# EasyEDA Pro project fg.eprj

# Schematic Schematic1
Board Name: Board1; Create Date: 2026-02-05; Page Name: P1; Project Name: FORKGUARD_MAIN_BOARD; Schematic Name: Schematic1; Update Date: 2026-02-05; Company: EasyEDA.com; Page Size: A4; Version: V1.0
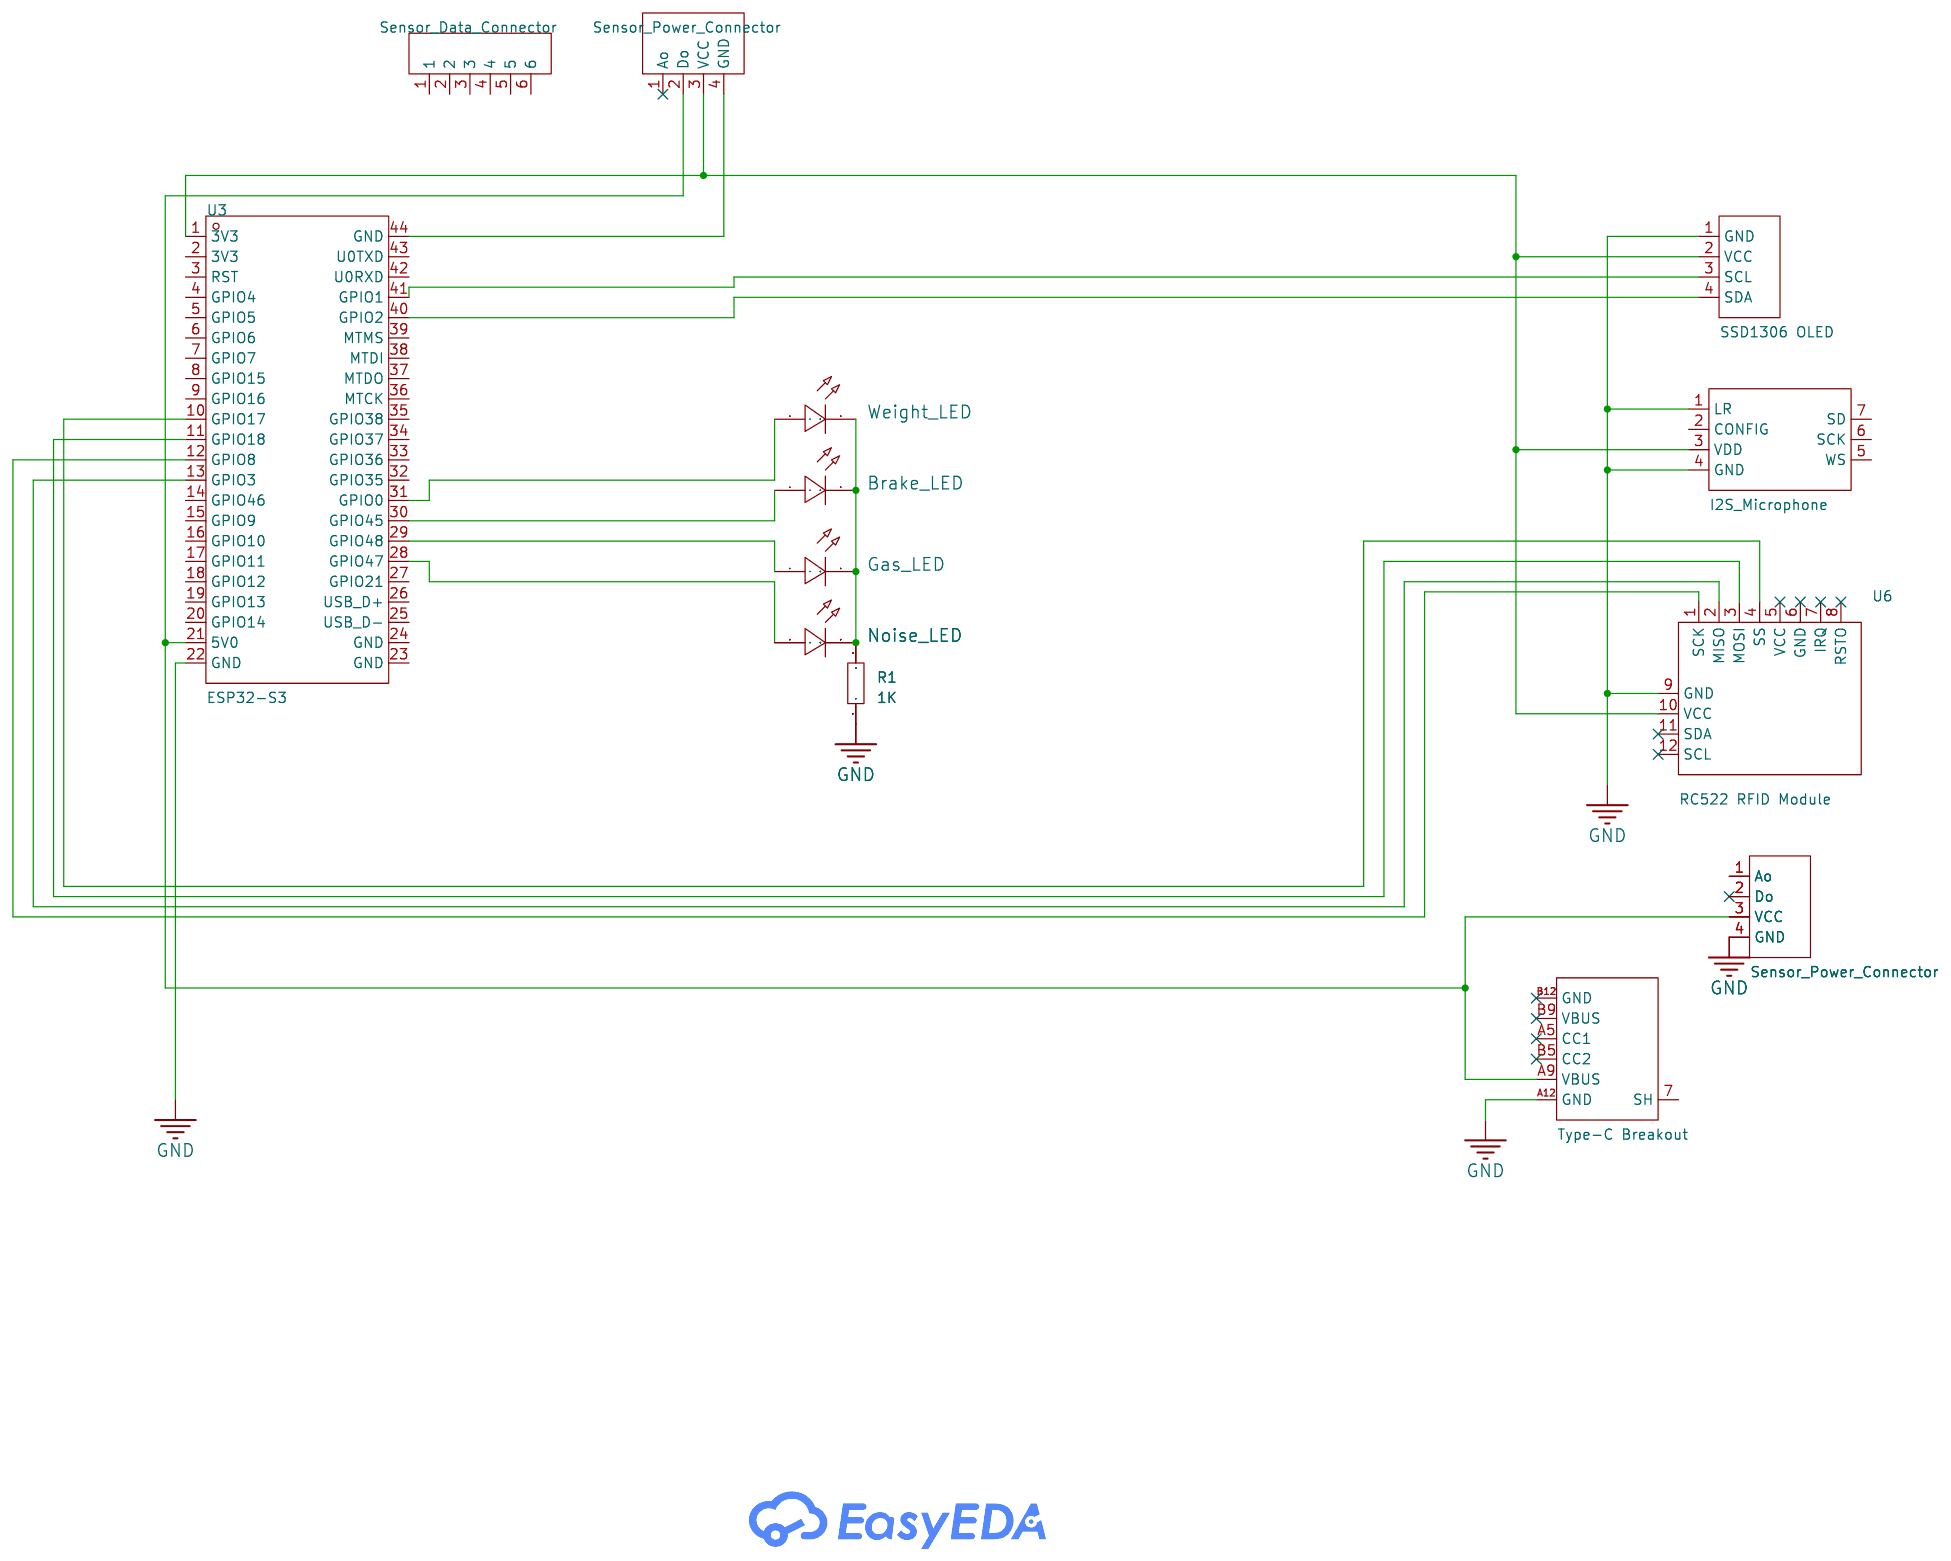
[diagram p0: schematic sheet]

## Parts
Brake_LED  -  [LED0402-RD_YELLOW]
Display  SSD1306 OLED  [OLED-TH_4P-L27.8-W27.3_MC096GW]
Gas_LED  -  [LED0402-RD_YELLOW]
H1  Sensor_Data_Connector  [HDR-TH_TW-06-01-T-S-150-085]
H2  Sensor_Power_Connector  [HDR-TH_TW-04-06-T-S-433-120]
H3  Sensor_Power_Connector  [HDR-TH_TW-04-06-T-S-433-120]
Noise_LED  -  [LED0402-RD_YELLOW]
R1  10K  [R0603]
U3  ESP32-S3  [COMM-TH_L63.3-W25.4-P2.54-LS22.86]
U5  I2S_Microphone  [MIC-SMD_7P-L4.0-W3.0-P2.15-TL]
U6  RC522 RFID Module  [COMM-TH_L42.7-W40.4_PN532_NFC_RFID]
USB1  Type-C Breakout  [USB-SMD_TYPE-C6P-ST]
Weight_LED  -  [LED0402-RD_YELLOW]

## Library data of the parts
Brake_LED Gas_LED Noise_LED Weight_LED = LED_0402-R: Supplier Footprint: 0402
Display = MC096GW: Supplier Part: C9900209498; Supplier Footprint: OLED-TH; Supplier: LCSC
H1 = TW-06-08-L-S-580-150: Supplier Part: C20390239; Manufacturer: SAMTEC; JLCPCB Part Class: Extended Part; Datasheet: https://item.szlcsc.com/datasheet/TW-06-08-L-S-580-150/21715804.html; Supplier: LCSC
H2 H3 = TW-04-05-L-S-275-158: Supplier Part: C20387770; Manufacturer: SAMTEC; JLCPCB Part Class: Extended Part; Datasheet: https://item.szlcsc.com/datasheet/TW-04-05-L-S-275-158/21713333.html; Supplier: LCSC
R1 = Res_0603: Supplier Footprint: 0603
U3 = ESP32-S3-DEV-KIT-N8R8: Supplier Part: C9900170771; Supplier Footprint: SMD; Supplier: LCSC
U5 = DMM-4026-B-I2S-R_C3171792: Direction:Omnidirectional Voltage - Supply:1.8V Voltage - Supply:1.8V Current Consumption:1mA Current Consumption:1mA S/N Ratio:64dB Sensitivity:-26dB Sensitivity:-26dB Impedance:-; LCSC Part Name: DMM-4026-B-I2S-R; Supplier Part: C3171792; Manufacturer: PUIAUDIO; Manufacturer Part: DMM-4026-B-I2S-R; JLCPCB Part Class: Extended Part; Datasheet: https://item.szlcsc.com/datasheet/DMM-4026-B-I2S-R/3733729.html; Supplier: LCSC; Direction: Omnidirectional; Voltage - Supply: 1.8V; Current Consumption: 1mA; S/N Ratio: 64dB; Sensitivity: -26dB
U6 = PN532 NFC RFID Module v4: Supplier Part: C9900233104; Supplier Footprint: 插件; Supplier: LCSC
USB1 = TCR51-65120601: Supplier Part: C9900021051; Supplier Footprint: USB-TYPE-C6P-ST; JLCPCB Part Class: Extended Part; Supplier: LCSC

## Nets
GND: Display.1(GND) H3.4(GND) R1.1 U3.22(GND) U5.1(LR) U5.4(GND) U6.9(GND) USB1.A12(GND)
$1N1686: H2.2(Do) H3.3(VCC) U3.21(5V0) USB1.A9(VBUS)
$1N1962: Display.2(VCC) H2.3(VCC) U3.1(3V3) U5.3(VDD) U6.10(VCC)
$1N2091: H2.4(GND) U3.44(GND)
$1N2540: U3.10(GPIO17) U6.4(SS)
$1N2555: U3.11(GPIO18) U6.3(MOSI)
$1N2585: U3.13(GPIO3) U6.2(MISO)
$1N2598: U3.12(GPIO8) U6.1(SCK)
$1N2675: Display.4(SDA) U3.40(GPIO2)
$1N2681: Display.3(SCL) U3.41(GPIO1)
$1N3400: Brake_LED.2(C) Gas_LED.2(C) Noise_LED.2(C) R1.2 Weight_LED.2(C)
$1N3552: Noise_LED.1(A) U3.28(GPIO47)
$1N3558: Gas_LED.1(A) U3.29(GPIO48)
$1N3571: U3.31(GPIO0) Weight_LED.1(A)
$1N3578: Brake_LED.1(A) U3.30(GPIO45)

Not connected (* = marked no-connect by the designer): H1 1 2 3 4 5 6; H2 1(Ao)*; H3 1(Ao) 2(Do)*; U3 2(3V3) 3(RST) 4(GPIO4) 5(GPIO5) 6(GPIO6) 7(GPIO7) 8(GPIO15) 9(GPIO16) 14(GPIO46) 15(GPIO9) 16(GPIO10) 17(GPIO11) 18(GPIO12) 19(GPIO13) 20(GPIO14) 23(GND) 24(GND) 25(USB_D-) 26(USB_D+) 27(GPIO21) 32(GPIO35) 33(GPIO36) 34(GPIO37) 35(GPIO38) 36(MTCK) 37(MTDO) 38(MTDI) 39(MTMS) 42(U0RXD) 43(U0TXD); U5 2(CONFIG) 5(WS) 6(SCK) 7(SD); U6 5(VCC)* 6(GND)* 7(IRQ)* 8(RSTO)* 11(SDA)* 12(SCL)*; USB1 7(SH) A5(CC1)* B5(CC2)* B9(VBUS)* B12(GND)*

# Board PCB1
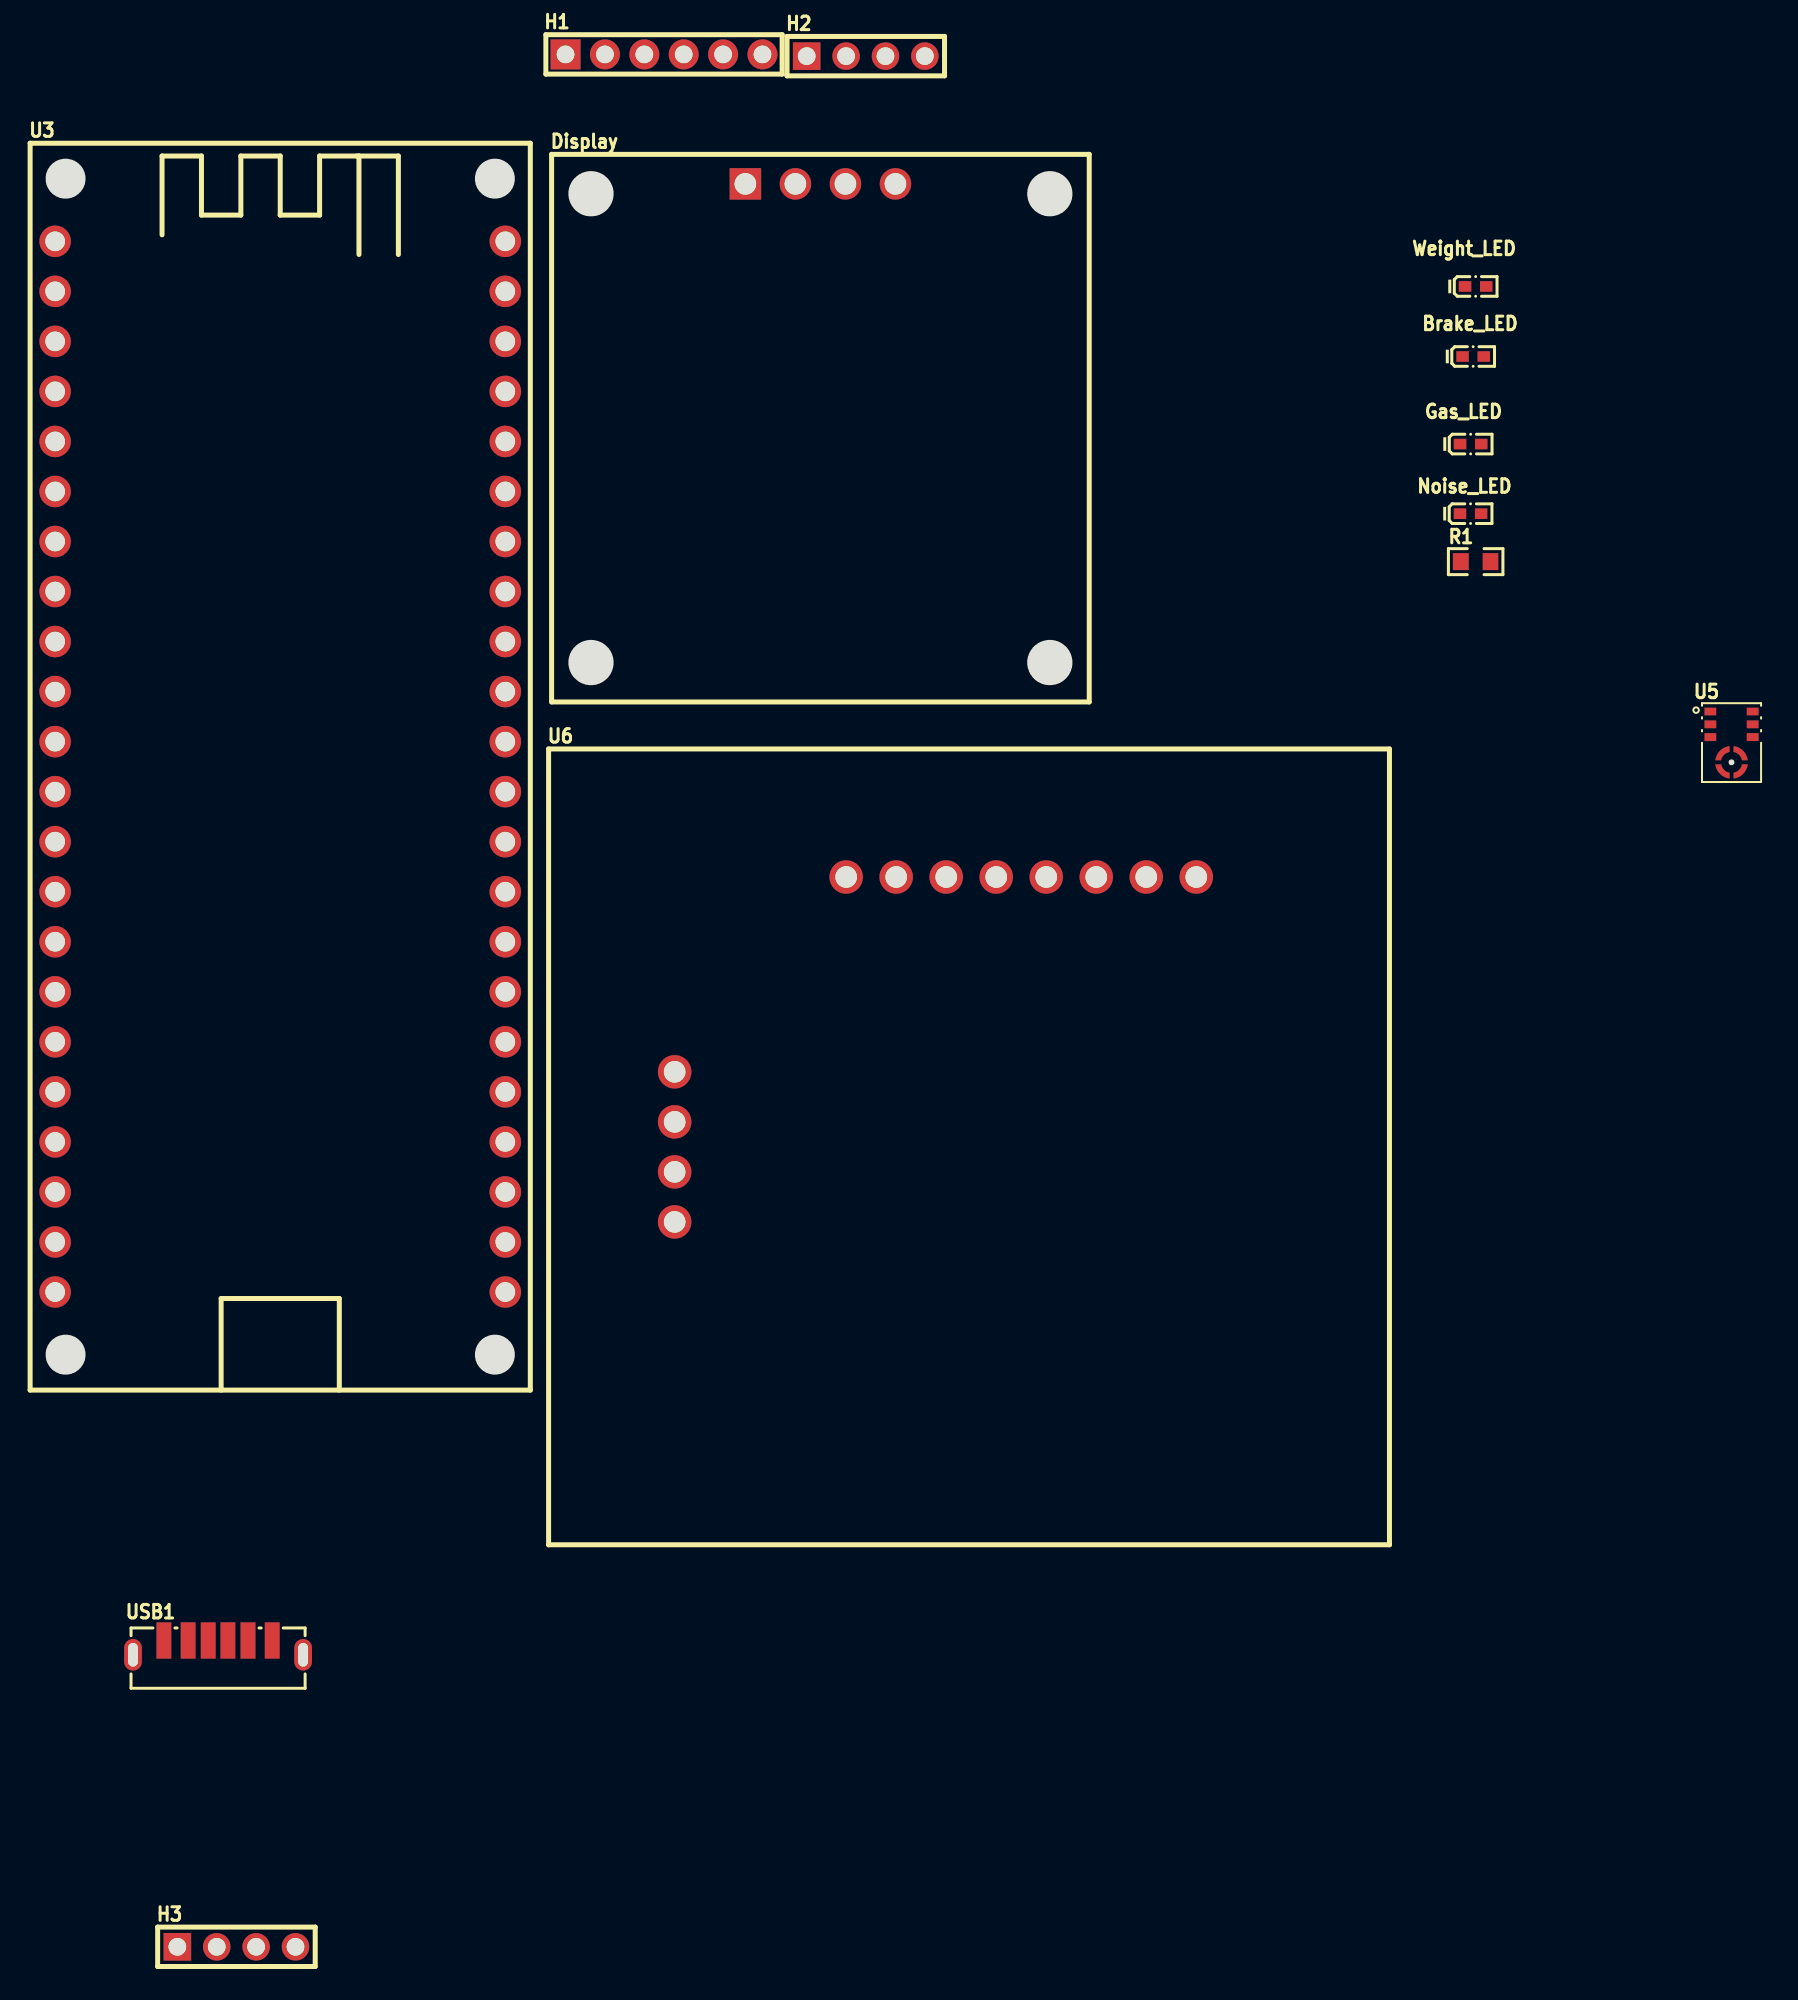
[diagram p1: board, top side]
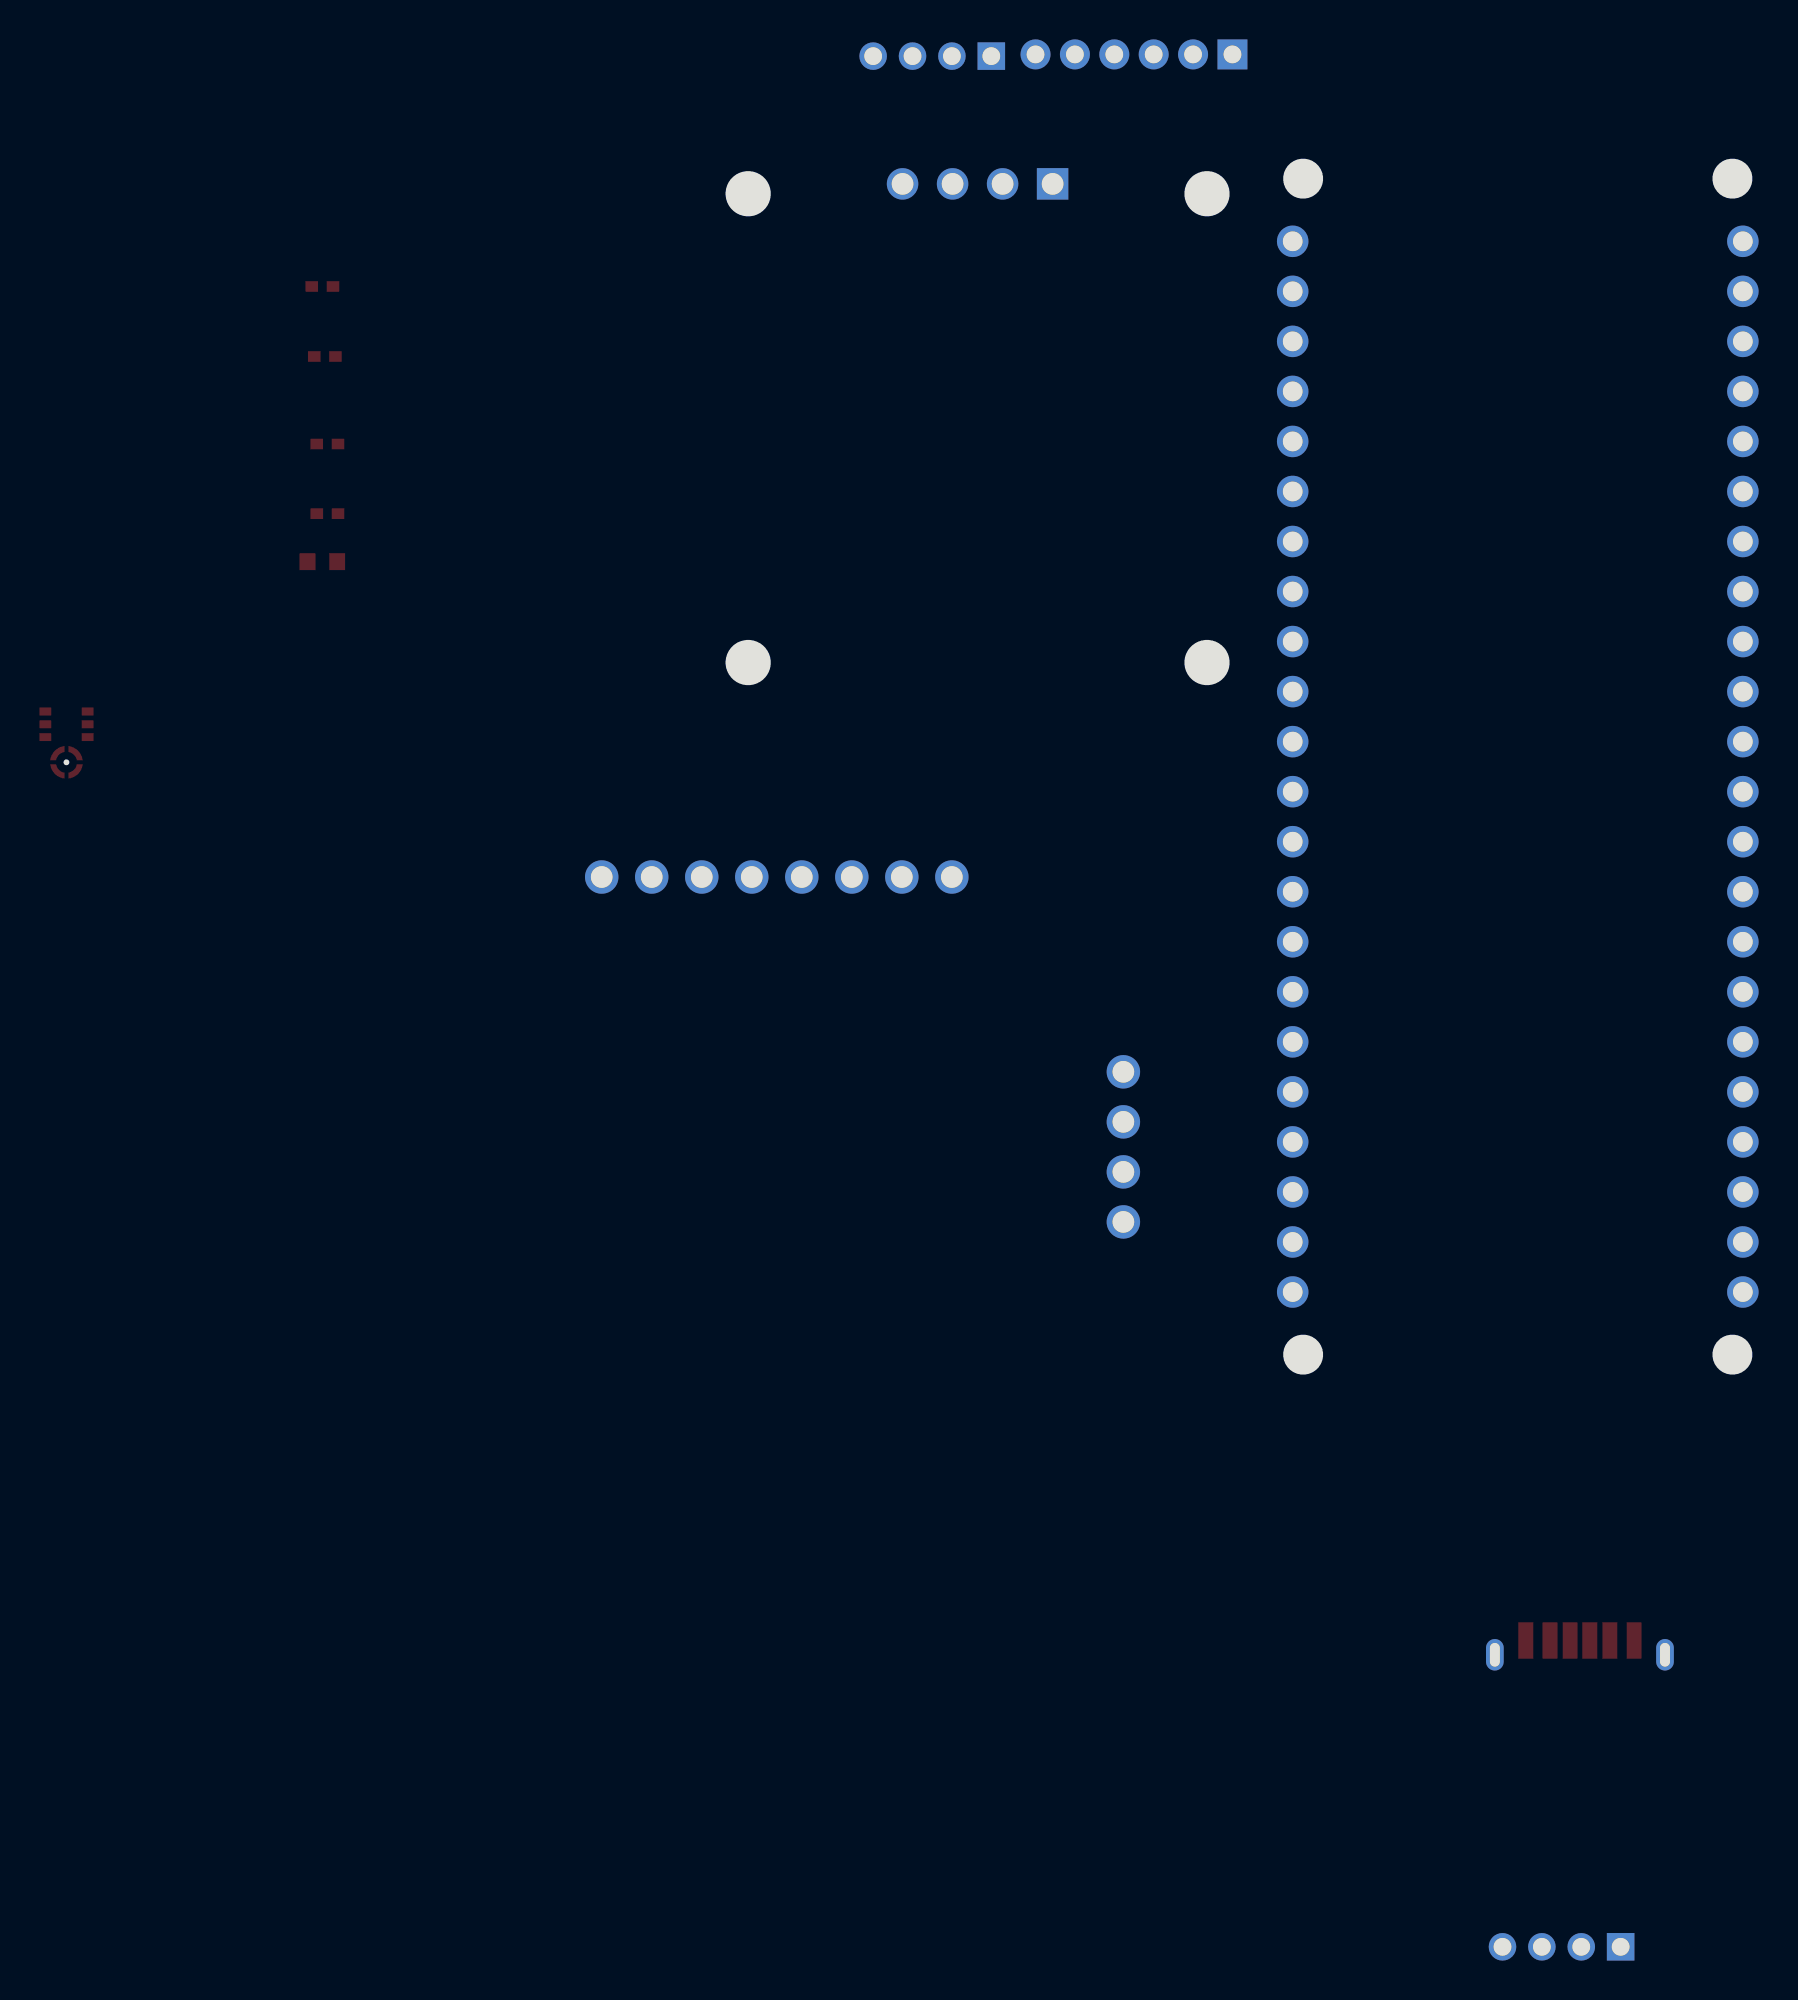
[diagram p2: board, bottom side, seen from below]

Outline 85.76 x 61.72 mm; copper layers: Top Layer, Bottom Layer. Coordinates in mm from the lower left corner of the outline.
Stack: Top Layer 0.035mm / Dielectric1 1.51mm FR4 er 4.5 / Bottom Layer 0.035mm

## Design rules (mm)
template: JLCPCB Capability(Two Layers Board)
spacing copperThickness1oz (default): track to track 0.102, other pairs 0.152 to 0.3
spacing copperThickness2oz: track to track 0.203, other pairs 0.152 to 0.3
track width copperThickness1oz (default): min 0.127, default 0.254, max 2.54
track width copperThickness2oz: min 0.203, default 0.254, max 2.54
differential pair differentialPair (default): width min 0.127, default 0.254, max 2.54; gap min 0.152, default 0.152
via viaSize (default): diameter min 0.5, default 0.61, max 10; hole min 0.3, default 0.305, max 6.3

## Placement (name value [footprint] x y rotation side)
Brake_LED  -  [LED0402-RD_YELLOW]  72.49 51.68 0 top
Display  SSD1306 OLED  [OLED-TH_4P-L27.8-W27.3_MC096GW]  39.34 60.45 0 top
Gas_LED  -  [LED0402-RD_YELLOW]  72.36 47.24 0 top
H1  Sensor_Data_Connector  [HDR-TH_TW-06-01-T-S-150-085]  31.4 67.02 0 top
H2  Sensor_Power_Connector  [HDR-TH_TW-04-06-T-S-433-120]  41.65 66.93 0 top
H3  Sensor_Power_Connector  [HDR-TH_TW-04-06-T-S-433-120]  9.69 -29.05 0 top
Noise_LED  -  [LED0402-RD_YELLOW]  72.36 43.7 0 top
R1  10K  [R0603]  72.62 41.27 0 top
U3  ESP32-S3  [COMM-TH_L63.3-W25.4-P2.54-LS22.86]  11.91 30.86 0 top
U5  I2S_Microphone  [MIC-SMD_7P-L4.0-W3.0-P2.15-TL]  85.61 32.13 0 top
U6  RC522 RFID Module  [COMM-TH_L42.7-W40.4_PN532_NFC_RFID]  45.19 16.5 0 top
USB1  Type-C Breakout  [USB-SMD_TYPE-C6P-ST]  8.76 -13.86 0 top
Weight_LED  -  [LED0402-RD_YELLOW]  72.62 55.24 0 top

## Footprints (pads in the part's own frame, mm; a bottom-side part is the same pattern mirrored in y, then rotated)
COMM-TH_L42.7-W40.4_PN532_NFC_RFID
  round 1.7 hole 1.1: 1(-4.535,8.755) 2(-1.995,8.755) 3(0.545,8.755) 4(3.085,8.755) 5(5.625,8.755) 6(8.165,8.755) 7(10.705,8.755) 8(13.245,8.755) 9(-13.245,-1.135) 10(-13.245,-3.675) 11(-13.245,-6.215) 12(-13.245,-8.755)
COMM-TH_L63.3-W25.4-P2.54-LS22.86
  round 1.6 hole 1: 1(-11.43,26.67) 2(-11.43,24.13) 3(-11.43,21.59) 4(-11.43,19.05) 5(-11.43,16.51) 6(-11.43,13.97) 7(-11.43,11.43) 8(-11.43,8.89) 9(-11.43,6.35) 10(-11.43,3.81) 11(-11.43,1.27) 12(-11.43,-1.27) 13(-11.43,-3.81) 14(-11.43,-6.35) 15(-11.43,-8.89) 16(-11.43,-11.43) 17(-11.43,-13.97) 18(-11.43,-16.51) 19(-11.43,-19.05) 20(-11.43,-21.59) 21(-11.43,-24.13) 22(-11.43,-26.67) 23(11.43,-26.67) 24(11.43,-24.13) 25(11.43,-21.59) 26(11.43,-19.05) 27(11.43,-16.51) 28(11.43,-13.97) 29(11.43,-11.43) 30(11.43,-8.89) 31(11.43,-6.35) 32(11.43,-3.81) 33(11.43,-1.27) 34(11.43,1.27) 35(11.43,3.81) 36(11.43,6.35) 37(11.43,8.89) 38(11.43,11.43) 39(11.43,13.97) 40(11.43,16.51) 41(11.43,19.05) 42(11.43,21.59) 43(11.43,24.13) 44(11.43,26.67)
HDR-TH_TW-04-06-T-S-433-120
  rect 1.4x1.4 hole 0.9: 1(-3,0)
  round 1.4 hole 0.9: 2(-1,0) 3(1,0) 4(3,0)
HDR-TH_TW-06-01-T-S-150-085
  rect 1.524x1.524 hole 0.9: 1(-5,0)
  round 1.524 hole 0.9: 2(-3,0) 3(-1,0) 4(1,0) 5(3,0) 6(5,0)
LED0402-RD_YELLOW
  rect 0.636x0.54 smd: 1(-0.538,0) 2(0.538,0)
MIC-SMD_7P-L4.0-W3.0-P2.15-TL
  rect 0.6x0.4 smd: 1(-1.075,1.53) 2(-1.075,0.88) 3(-1.075,0.231) 5(1.075,0.231) 6(1.075,0.88) 7(1.075,1.53)
  custom 0.725x0.725 smd: 4(-0.481,-1.512) 4(-0.463,-0.569) 4(0.463,-1.53) 4(0.481,-0.587)
OLED-TH_4P-L27.8-W27.3_MC096GW
  rect 1.6x1.6 hole 1.1: 1(-3.81,0)
  round 1.6 hole 1.1: 2(-1.27,0) 3(1.27,0) 4(3.81,0)
R0603
  rect 0.806x0.864 smd: 1(-0.753,0) 2(0.753,0)
USB-SMD_TYPE-C6P-ST
  oval 0.9x1.6 hole 0.5x1.2: 7(-4.32,-0.362) 7(4.32,-0.362)
  rect 0.76x1.85 smd: A5(-0.5,0.362) A9(1.52,0.362) A12(2.75,0.362) B5(0.5,0.362) B9(-1.52,0.362) B12(-2.75,0.362)

## Nets
As in the schematic.

Pads without a net: H1 1 2 3 4 5 6; H2 1; H3 1 2; U3 2 3 4 5 6 7 8 9 14 15 16 17 18 19 20 23 24 25 26 27 32 33 34 35 36 37 38 39 42 43; U5 2 5 6 7; U6 5 6 7 8 11 12; USB1 7 A5 B5 B9 B12
